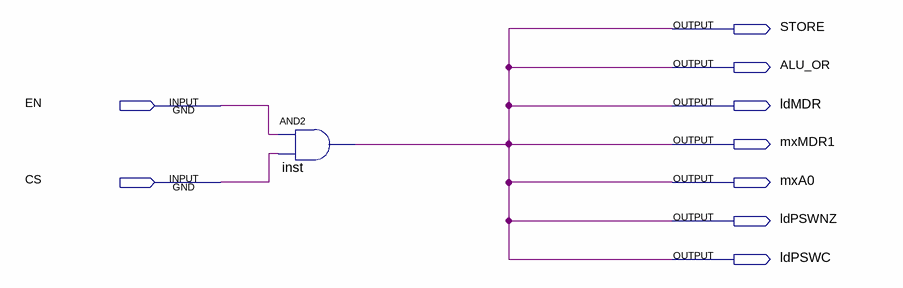
[diagram p0: schematic sheet]
// Quartus schematic LSL.bdf as structural Verilog: 1 symbols, 9 pins
module LSL (
  input  EN,
  input  CS,
  output STORE,
  output ALU_OR,
  output ldMDR,
  output mxMDR1,
  output mxA0,
  output ldPSWNZ,
  output ldPSWC
);

  and inst (ALU_OR, EN, CS);

  assign ldMDR = ALU_OR;
  assign ldPSWC = ALU_OR;
  assign ldPSWNZ = ALU_OR;
  assign mxA0 = ALU_OR;
  assign mxMDR1 = ALU_OR;
  assign STORE = ALU_OR;
endmodule
